# Altium schematic sheet project_vodorezov_switch2.SchDoc
size 594 x 420 mm
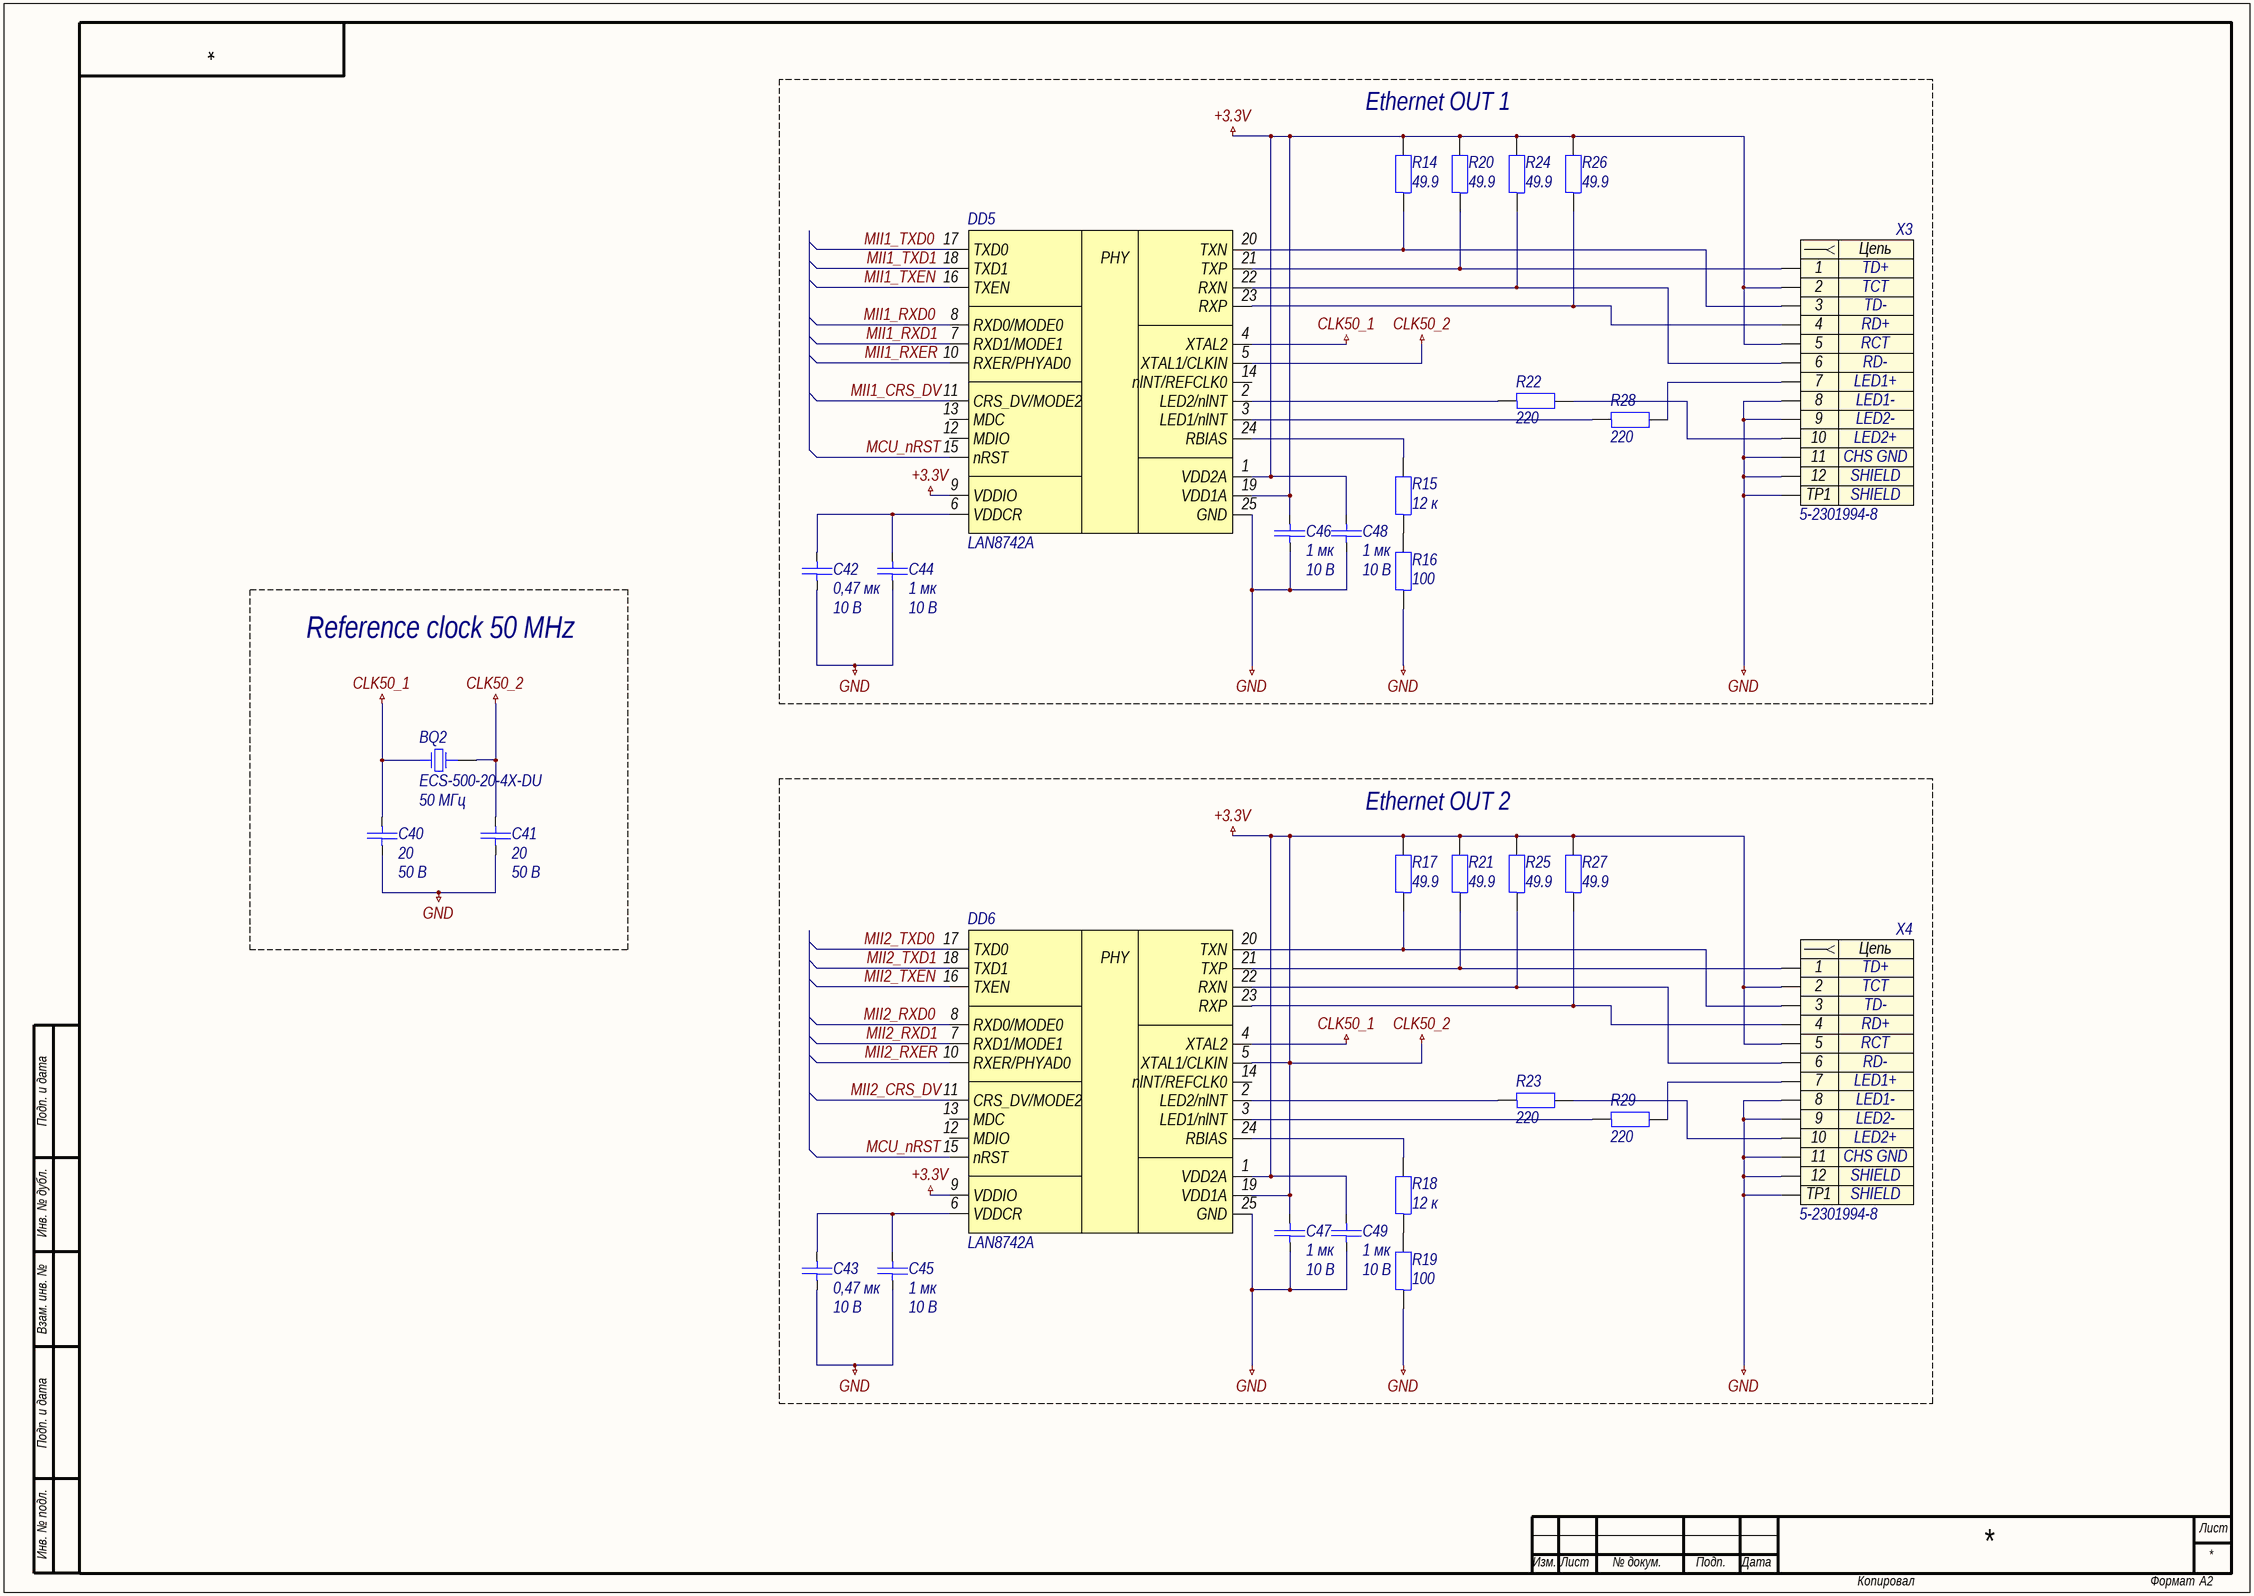
[diagram p0: project_vodorezov_switch2.SchDoc]

## Parts
BQ2  ECS-500-20-4X-DU  Частотa: 50 МГц  [HC-49/US]
C40  20  Напряжение: 50 В  [C0402]
C41  20  Напряжение: 50 В  [C0402]
C42  0,47 мк  Напряжение: 10 В  [C0603]
C43  0,47 мк  Напряжение: 10 В  [C0603]
C44  1 мк  Напряжение: 10 В  [C0603]
C45  1 мк  Напряжение: 10 В  [C0603]
C46  1 мк  Напряжение: 10 В  [C0603]
C47  1 мк  Напряжение: 10 В  [C0603]
C48  1 мк  Напряжение: 10 В  [C0603]
C49  1 мк  Напряжение: 10 В  [C0603]
DD5  LAN8742A  [QFN-24-P50-400X400X80-L40X25-T270X270]
DD6  LAN8742A  [QFN-24-P50-400X400X80-L40X25-T270X270]
R14  49.9  [R0603]
R15  12 к  [R0603]
R16  100  [R0603]
R17  49.9  [R0603]
R18  12 к  [R0603]
R19  100  [R0603]
R20  49.9  [R0603]
R21  49.9  [R0603]
R22  220  [R0603]
R23  220  [R0603]
R24  49.9  [R0603]
R25  49.9  [R0603]
R26  49.9  [R0603]
R27  49.9  [R0603]
R28  220  [R0603]
R29  220  [R0603]
X3  5-2301994-8  [5-2301994-8]
X4  5-2301994-8  [5-2301994-8]

## Blocks framed on the sheet
Ethernet OUT 1: C42 C44 C46 C48 DD5 R14-R16 R20 R22 R24 R26 R28 X3
Reference clock 50 MHz: BQ2 C40 C41
Ethernet OUT 2: C43 C45 C47 C49 DD6 R17-R19 R21 R23 R25 R27 R29 X4

## Nets
+3.3V: BQ2.2 C41.1 C46.1 C47.1 C48.1 C49.1 DD5.1(VDD2A) DD5.5(XTAL1/CLKIN) DD5.9(VDDIO) DD5.19(VDD1A) DD6.1(VDD2A) DD6.5(XTAL1/CLKIN) DD6.9(VDDIO) DD6.19(VDD1A) R14.2 R17.2 R20.2 R21.2 R24.2 R25.2 R26.2 R27.2 X3.2 X3.5 X4.2 X4.5  [also labelled CLK50_2]
CLK50_1: BQ2.1 C40.1 DD5.4(XTAL2) DD6.4(XTAL2)
GND: C40.2 C41.2 C42.2 C43.2 C44.2 C45.2 C46.2 C47.2 C48.2 C49.2 DD5.25(GND) DD6.25(GND) R16.1 R19.1 X3.8 X3.9 X3.11 X3.12 X3.TP1 X4.8 X4.9 X4.11 X4.12 X4.TP1
MCU_nRST: DD5.15(nRST) DD6.15(nRST)
MII1_CRS_DV: DD5.11(CRS_DV/MODE2)
MII1_RXD0: DD5.8(RXD0/MODE0)
MII1_RXD1: DD5.7(RXD1/MODE1)
MII1_RXER: DD5.10(RXER/PHYAD0)
MII1_TXD0: DD5.17(TXD0)
MII1_TXD1: DD5.18(TXD1)
MII1_TXEN: DD5.16(TXEN)
MII2_CRS_DV: DD6.11(CRS_DV/MODE2)
MII2_RXD0: DD6.8(RXD0/MODE0)
MII2_RXD1: DD6.7(RXD1/MODE1)
MII2_RXER: DD6.10(RXER/PHYAD0)
MII2_TXD0: DD6.17(TXD0)
MII2_TXD1: DD6.18(TXD1)
MII2_TXEN: DD6.16(TXEN)
NetC42_1: C42.1 C44.1 DD5.6(VDDCR)
NetC43_1: C43.1 C45.1 DD6.6(VDDCR)
NetDD5_2: DD5.2(LED2/nlNT) R22.1
NetDD5_3: DD5.3(LED1/nlNT) R28.1
NetDD5_20: DD5.20(TXN) R14.1 X3.3
NetDD5_21: DD5.21(TXP) R20.1 X3.1
NetDD5_22: DD5.22(RXN) R24.1 X3.6
NetDD5_23: DD5.23(RXP) R26.1 X3.4
NetDD5_24: DD5.24(RBIAS) R15.2
NetDD6_2: DD6.2(LED2/nlNT) R23.1
NetDD6_3: DD6.3(LED1/nlNT) R29.1
NetDD6_20: DD6.20(TXN) R17.1 X4.3
NetDD6_21: DD6.21(TXP) R21.1 X4.1
NetDD6_22: DD6.22(RXN) R25.1 X4.6
NetDD6_23: DD6.23(RXP) R27.1 X4.4
NetDD6_24: DD6.24(RBIAS) R18.2
NetR15_1: R15.1 R16.2
NetR18_1: R18.1 R19.2
NetR22_2: R22.2 X3.10
NetR23_2: R23.2 X4.10
NetR28_2: R28.2 X3.7
NetR29_2: R29.2 X4.7

Not connected (* = marked no-connect by the designer): DD5 12(MDIO) 13(MDC) 14(nlNT/REFCLK0); DD6 12(MDIO) 13(MDC) 14(nlNT/REFCLK0)

## Notes on the sheet
- Подп. и дата
- Инв. № дубл.
- Взам. инв. №
- Инв. № подл.
- Лист
- Изм.
- № докум.
- Подп.
- Дата
- Копировал
- Формат
- А2
- (in symbol dd0028) PHY
- (in symbol x0015) Цепь

## Library data of the parts
BQ2 = bq0007: =Описание; ID: bq0007; Фамилия: Водорезов; Описание: Кварцевый резонатор 50 МГц нагрузочные конденсаторы 20 пФ; Производитель: ECS, Inc. International; Наименование: ECS-500-20-4X-DU; Частота: 50 МГц; Корпус: HC-49/US; HelpURL: https://ecsxtal.com/hc-49usx
C40 C41 = c0020: =Описание; ID: c0020; Фамилия: Ляпцев; Описание: Конденсатор керамический чип 0402 20 пФ 50 В ±5 %; Наименование: CC0402JRNPO9BN200; Производитель: YAGEO Corp.; Отклонение: ±5 %; Рабочие температуры: от –55 °С до +125 °С; Температурный коэффициент емкости: C0G; Корпус: 0402; Номинал: 20; Номинальное напряжение: 50 В; HelpURL: https://www.yageo.com/upload/media/product/productsearch/datasheet/mlcc/UPY-GP_NP0_16V-to-50V_18.pdf
C42 C43 = c0103: =Описание; ID: c0103; Фамилия: Паньков; Описание: Конденсатор керамический чип 0603 470 нФ 10 В ±10 %; Наименование: CC0603KRX7R6BB474; Производитель: YAGEO Corp.; Отклонение: ±10 %; Рабочие температуры: от –55 °С до +125 °С; Температурный коэффициент емкости: X7R; Корпус: 0603; Номинал: 0,47 мк; Номинальное напряжение: 10 В; HelpURL: https://www.yageo.com/upload/media/product/productsearch/datasheet/mlcc/UPY-GPHC_X7R_6.3V-to-50V_20.pdf
C44-C49 = c0112: =Описание; ID: c0112; Фамилия: Паньков; Описание: Конденсатор керамический чип 0603 1 мкФ 10 В ±10 %; Наименование: CC0603KRX5R6BB105; Производитель: YAGEO Corp.; Отклонение: ±10 %; Рабочие температуры: от –55 °С до +85 °С; Температурный коэффициент емкости: X5R; Корпус: 0603; Номинал: 1 мк; Номинальное напряжение: 10 В; HelpURL: https://www.yageo.com/upload/media/product/productsearch/datasheet/mlcc/UPY-GPHC_X5R_4V-to-50V_26.pdf
DD5 DD6 = dd0028: =Описание; ID: dd0028; Фамилия: Водорезов; Описание: Ethernet-transiver PHY; Производитель: Microchip; Корпус: QFN-24; Наименование: LAN8742A; HelpURL: http://ww1.microchip.com/downloads/en/DeviceDoc/8742a.pdf
R14 R17 R20 R21 R24-R27 = r0204: =Описание; ID: r0204; Фамилия: Водорезов; Описание: Резистор чип 0603 49 Ом ±1 % 0,1 Вт; Наименование: RC0603FR-0749RL; Производитель: YAGEO Corp.; Отклонение: ±1 %; Номинальное напряжение: 75 В; Номинальный ток: 1 А; Рабочие температуры: от –55 °С до +155 °С; Корпус: 0603; Примечание: Ряд E24; Номинал: 49.9; HelpURL: https://www.yageo.com/upload/media/product/productsearch/datasheet/rchip/PYu-RC_Group_51_RoHS_L_11.pdf
R15 R18 = r0108: =Описание; ID: r0108; Фамилия: Паньков; Описание: Резистор чип 0603 12 кОм ±1 % 0,1 Вт; Наименование: RC0603FR-0712KL; Производитель: YAGEO Corp.; Отклонение: ±1 %; Номинальное напряжение: 75 В; Номинальный ток: 1 А; Рабочие температуры: от –55 °С до +155 °С; Корпус: 0603; Примечание: Ряд E24; Номинал: 12 к; HelpURL: https://www.yageo.com/upload/media/product/productsearch/datasheet/rchip/PYu-RC_Group_51_RoHS_L_11.pdf
R16 R19 = r0052: =Описание; ID: r0052; Фамилия: Самарин; Описание: Резистор чип 0603 100 Ом ±1 % 0,1 Вт; Наименование: RC0603FR‍‐07100RL; Производитель: YAGEO Corp.; Отклонение: ±1 %; Номинальное напряжение: 75 В; Номинальный ток: 1 А; Рабочие температуры: от –55 °С до +155 °С; Корпус: 0603; Примечание: Ряд E24; Номинал: 100; HelpURL: https://www.yageo.com/upload/media/product/productsearch/datasheet/rchip/PYu-RC_Group_51_RoHS_L_11.pdf
R22 R23 R28 R29 = r0060: =Описание; ID: r0060; Фамилия: Ларионов; Описание: Резистор чип 0603 220 Ом ±1 % 0,1 Вт; Наименование: RC0603FR-07220RL; Производитель: YAGEO Corp.; Отклонение: ±1 %; Номинальное напряжение: 75 В; Номинальный ток: 1 А; Рабочие температуры: от –55 °С до +155 °С; Корпус: 0603; Примечание: Ряд E24; Номинал: 220; HelpURL: https://www.yageo.com/upload/media/product/productsearch/datasheet/rchip/PYu-RC_Group_51_RoHS_L_11.pdf
X3 X4 = x0015: =Описание; Contact_1: TD+; Contact_2: TCT; Contact_3: TD-; Contact_4: RD+; Contact_5: RCT; Contact_6: RD-; Contact_7: LED1+; Contact_8: LED1-; Contact_9: LED2-; Contact_10: LED2+; Contact_11: CHS GND; TP1: SHIELD; ID: x0015; Фамилия: Ларионов; Описание: RJ45 интегрированный трансформатор 10/100 Mbps LED гнездо угловой; Производитель: TE Connectivity; Contact_12: SHIELD; Наименование: 5-2301994-8; HelpURL: https://www.te.com/usa-en/product-5-2301994-8.html